# Altium schematic sheet Done.SchDoc
size A4; Organization: Altium Limited; Address1: L3, 12a Rodborough Rd; Address2: Frenchs Forest; Address3: NSW; Address4: Australia 2086
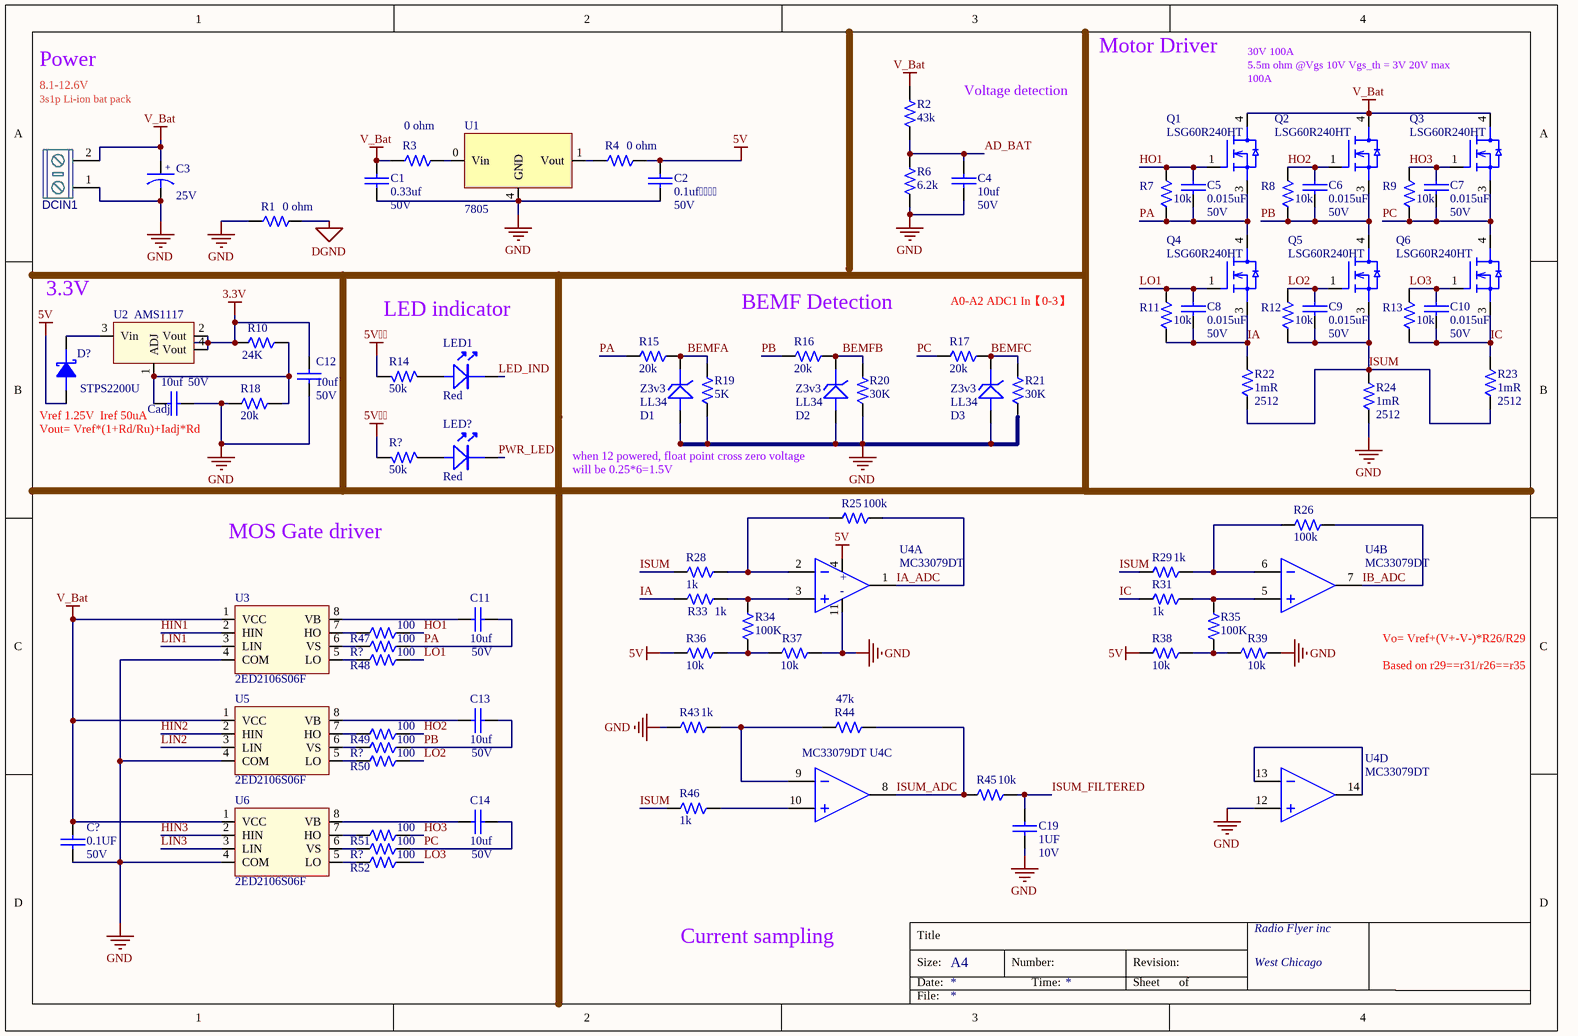
[diagram p0: Done.SchDoc]

## Parts
(Parts that share a designator on the sheet are numbered #1, #2 ... from top to bottom, then left to right.)
C1  value 0.33uf  Voltage: 50V  [CAPC0603-RW]  (hidden comment: PXL456470-1530)
C2  value 0.1uf  Voltage: 50V  [CAPC0603-RW]  (hidden comment: PXL456470-1530)
C3  Voltage: 25V  [CASE - G]  (hidden comment: PBE099550-4710)
C4  value 10uf  Voltage: 50V  [CAPC0603-RW]  (hidden comment: PXL456470-1530)
C5  value 0.015uF  Voltage: 50V  [CAPC0603-RW]  (hidden comment: PXL456470-1530)
C6  value 0.015uF  Voltage: 50V  [CAPC0603-RW]  (hidden comment: PXL456470-1530)
C7  value 0.015uF  Voltage: 50V  [CAPC0603-RW]  (hidden comment: PXL456470-1530)
C8  value 0.015uF  Voltage: 50V  [CAPC0603-RW]  (hidden comment: PXL456470-1530)
C9  value 0.015uF  Voltage: 50V  [CAPC0603-RW]  (hidden comment: PXL456470-1530)
C10  value 0.015uF  Voltage: 50V  [CAPC0603-RW]  (hidden comment: PXL456470-1530)
C11  value 10uf  Voltage: 50V  [CAPC0603-RW]  (hidden comment: PXL456470-1530)
C12  value 10uf  Voltage: 50V  [CAPC0603-RW]  (hidden comment: PXL456470-1530)
C13  value 10uf  Voltage: 50V  [CAPC0603-RW]  (hidden comment: PXL456470-1530)
C14  value 10uf  Voltage: 50V  [CAPC0603-RW]  (hidden comment: PXL456470-1530)
C19  value 1UF  Voltage: 10V  [CAPC0603-SW]  (hidden comment: PXL456470-1530)
C?  value 0.1UF  Voltage: 50V  [CAPC0603-RW]  (hidden comment: PXL456470-1530)
Cadj  value 10uf  Voltage: 50V  [CAPC0603-RW]  (hidden comment: PXL456470-1530)
D1  MFG Part: Z3v3  [LL34]  (hidden comment: RCZ005015-0020)
D2  MFG Part: Z3v3  [LL34]  (hidden comment: RCZ005015-0020)
D3  MFG Part: Z3v3  [LL34]  (hidden comment: RCZ005015-0020)
D?  MFG Part: STPS2200U  [SMB]  (hidden comment: DIO STPS2200U)
DCIN1  KF/WJ/DG 30x connecter  [KF/WJ/DG 301-2p-5.0mm]  (value not drawn)
LED1  Color: Red  [LED1206-RED]  (hidden comment: LED1206R_23-21\R6C-AM1N2AY\2A)
LED?  Color: Red  [LED1206-RED]  (hidden comment: LED1206R_23-21\R6C-AM1N2AY\2A)
Q1  MFG Part: LSG60R240HT  [TO252-3]  (hidden comment: T5860038503A6)
Q2  MFG Part: LSG60R240HT  [TO252-3]  (hidden comment: T5860038503A6)
Q3  MFG Part: LSG60R240HT  [TO252-3]  (hidden comment: T5860038503A6)
Q4  MFG Part: LSG60R240HT  [TO252-3]  (hidden comment: T5860038503A6)
Q5  MFG Part: LSG60R240HT  [TO252-3]  (hidden comment: T5860038503A6)
Q6  MFG Part: LSG60R240HT  [TO252-3]  (hidden comment: T5860038503A6)
R1  value 0 ohm  [0603-RW]  (hidden comment: T502210202399)
R2  value 43k  [0603-RW]  (hidden comment: T5024421083A9)
R3  value 0 ohm  [0603-RW]  (hidden comment: T502210202399)
R4  value 0 ohm  [0603-RW]  (hidden comment: T502210202399)
R6  value 6.2k  [0603-RW]  (hidden comment: T5024421083A9)
R7  value 10k  [0603-RW]  (hidden comment: T5024421083A9)
R8  value 10k  [0603-RW]  (hidden comment: T5024421083A9)
R9  value 10k  [0603-RW]  (hidden comment: T5024421083A9)
R10  value 24K  [0603-RW]  (hidden comment: T5024421083A9)
R11  value 10k  [0603-RW]  (hidden comment: T5024421083A9)
R12  value 10k  [0603-RW]  (hidden comment: T5024421083A9)
R13  value 10k  [0603-RW]  (hidden comment: T5024421083A9)
R14  value 50k  [0603-RW]  (hidden comment: T5024421083A9)
R15  value 20k  [0603-RW]  (hidden comment: T5024421083A9)
R16  value 20k  [0603-RW]  (hidden comment: T5024421083A9)
R17  value 20k  [0603-RW]  (hidden comment: T5024421083A9)
R18  value 20k  [0603-RW]  (hidden comment: T5024421083A9)
R19  value 5K  [0603-RW]  (hidden comment: T5024421083A9)
R20  value 30K  [0603-RW]  (hidden comment: T5024421083A9)
R21  value 30K  [0603-RW]  (hidden comment: T5024421083A9)
R22  value 1mR  [2512]  (hidden comment: QCF101250-1009)
R23  value 1mR  [2512]  (hidden comment: QCF101250-1009)
R24  value 1mR  [2512]  (hidden comment: QCF101250-1009)
R25  value 100k  [0603-RW]  (hidden comment: T5024421083A9)
R26  value 100k  [0603-RW]  (hidden comment: T5024421083A9)
R28  value 1k  [0603-RW]  (hidden comment: T5024421083A9)
R29  value 1k  [0603-RW]  (hidden comment: T5024421083A9)
R31  value 1k  [0603-RW]  (hidden comment: T5024421083A9)
R33  value 1k  [0603-RW]  (hidden comment: T5024421083A9)
R34  value 100K  [0603-RW]  (hidden comment: T5024421083A9)
R35  value 100K  [0603-RW]  (hidden comment: T5024421083A9)
R36  value 10k  [0603-RW]  (hidden comment: T5024421083A9)
R37  value 10k  [0603-RW]  (hidden comment: T5024421083A9)
R38  value 10k  [0603-RW]  (hidden comment: T5024421083A9)
R39  value 10k  [0603-RW]  (hidden comment: T5024421083A9)
R43  value 1k  [0603-RW]  (hidden comment: T5024421083A9)
R44  value 47k  [0603-RW]  (hidden comment: T5024421083A9)
R45  value 10k  [0603-RW]  (hidden comment: T5024421083A9)
R46  value 1k  [0603-RW]  (hidden comment: T5024421083A9)
R47  value 100  [0603-RW]  (hidden comment: T5024421083A9)
R48  value 100  [0603-RW]  (hidden comment: T5024421083A9)
R49  value 100  [0603-RW]  (hidden comment: T5024421083A9)
R50  value 100  [0603-RW]  (hidden comment: T5024421083A9)
R51  value 100  [0603-RW]  (hidden comment: T5024421083A9)
R52  value 100  [0603-RW]  (hidden comment: T5024421083A9)
R?#1  value 50k  [0603-RW]  (hidden comment: T5024421083A9)
R?#2  value 100  [0603-RW]  (hidden comment: T5024421083A9)
R?#3  value 100  [0603-RW]  (hidden comment: T5024421083A9)
R?#4  value 100  [0603-RW]  (hidden comment: T5024421083A9)
U1  7805  [TO-263]
U2  AMS1117  [SOT223]
U3  T610900027257  [SO8]  (value not drawn)
U4  RCI033079-0002  [SO14]  (value not drawn)  (parts A,B,C,D of 4)
U5  T610900027257  [SO8]  (value not drawn)
U6  T610900027257  [SO8]  (value not drawn)

## Nets
3.3V: C12.1 R10.2 U2.2(Vout) U2.4(Vout)
5V: C2.1 D?.1(A) R4.2 R36.2 R38.2 U4.4(+V)
5V: R14.1 R?#1.1
DGND: R1.2
GND: C1.2 C2.2 C3.2 C4.2 C12.2 C19.1 C?.1 Cadj.2 D1.1(A) D2.1(A) D3.1(A) DCIN1.1 R1.1 R6.2 R18.2 R19.2 R20.2 R21.2 R24.1 R37.1 R39.1 R43.2 U1.4(GND) U3.4(COM) U4.11(-V) U4.12(IN+) U5.4(COM) U6.4(COM)
V_Bat: C1.1 C3.1 C?.2 DCIN1.2 Q1.4(D) Q2.4(D) Q3.4(D) R2.1 R3.1 U3.1(VCC) U5.1(VCC) U6.1(VCC)
AD_BAT: C4.1 R2.2 R6.1
BEMFA: D1.2(K) R15.1 R19.1
BEMFB: D2.2(K) R16.1 R20.1
BEMFC: D3.2(K) R17.1 R21.1
HIN1: U3.2(HIN)
HIN2: U5.2(HIN)
HIN3: U6.2(HIN)
HO1: C5.2 Q1.1(G) R7.2 R47.1
HO2: C6.2 Q2.1(G) R8.2 R49.1
HO3: C7.2 Q3.1(G) R9.2 R51.1
IA: C8.1 Q4.3(S) R11.1 R22.2 R33.2
IA_ADC: R25.1 U4.1(OUT)
IB_ADC: R26.1 U4.7(OUT)
IC: C10.1 Q6.3(S) R13.1 R23.2 R31.2
ISUM: C9.1 Q5.3(S) R12.1 R22.1 R23.1 R24.2 R28.2 R29.2 R46.2
ISUM_ADC: R44.1 R45.2 U4.8(OUT)
ISUM_FILTERED: C19.2 R45.1
LED_IND: LED1.2(K)
LIN1: U3.3(LIN)
LIN2: U5.3(LIN)
LIN3: U6.3(LIN)
LO1: C8.2 Q4.1(G) R11.2 R48.1
LO2: C9.2 Q5.1(G) R12.2 R50.1
LO3: C10.2 Q6.1(G) R13.2 R52.1
PA: C5.1 C11.2 Q1.3(S) Q4.4(D) R7.1 R15.2 R?#2.1
PB: C6.1 C13.2 Q2.3(S) Q5.4(D) R8.1 R16.2 R?#3.1
PC: C7.1 C14.2 Q3.3(S) Q6.4(D) R9.1 R17.2 R?#4.1
PWR_LED: LED?.2(K)
NetC11_1: C11.1 U3.8(VB)
NetC13_1: C13.1 U5.8(VB)
NetC14_1: C14.1 U6.8(VB)
NetCadj_1: Cadj.1 R10.1 R18.1 U2.1(ADJ)
NetD?_2: D?.2(K) U2.3(Vin)
NetLED1_1: LED1.1(A) R14.2
NetLED?_1: LED?.1(A) R?#1.2
NetR3_2: R3.2 U1.0(Vin)
NetR4_1: R4.1 U1.1(Vout)
NetR25_2: R25.2 R28.1 U4.2(IN-)
NetR26_2: R26.2 R29.1 U4.6(IN-)
NetR31_1: R31.1 R35.1 U4.5(IN+)
NetR33_1: R33.1 R34.1 U4.3(IN+)
NetR34_2: R34.2 R36.1 R37.2
NetR35_2: R35.2 R38.1 R39.2
NetR43_1: R43.1 R44.2 U4.9(IN-)
NetR46_1: R46.1 U4.10(IN+)
NetR47_2: R47.2 U3.7(HO)
NetR48_2: R48.2 U3.5(LO)
NetR49_2: R49.2 U5.7(HO)
NetR50_2: R50.2 U5.5(LO)
NetR51_2: R51.2 U6.7(HO)
NetR52_2: R52.2 U6.5(LO)
NetR?#2_2: R?#2.2 U3.6(VS)
NetR?#3_2: R?#3.2 U5.6(VS)
NetR?#4_2: R?#4.2 U6.6(VS)
NetU4_13: U4.13(IN-) U4.14(OUT)

## Notes on the sheet
- Power
- 3s1p Li-ion bat pack
- 8.1-12.6V
- Voltage detection
- Motor Driver
- 30V 100A
- 5.5m ohm @Vgs 10V Vgs_th = 3V 20V max
- (near Q1) 100A
- 3.3V
- BEMF Detection
- A0-A2 ADC1 In【0-3】
- LED indicator
- (near Cadj) Vref 1.25V  Iref 50uA
- Vout= Vref*(1+Rd/Ru)+Iadj*Rd
- when 12 powered, float point cross zero voltage
- will be 0.25*6=1.5V
- MOS Gate driver
- Vo= Vref+(V+-V-)*R26/R29
- Based on r29==r31/r26==r35
- Current sampling
- Title
- Size:
- Date:
- A4
- Number:
- Time:
- Revision:
- Sheet
- of
- Radio Flyer inc
- West Chicago
- File:
- (in symbol CAP E 470uF 25V 20% SMD) +
- (in symbol MC33079DT, part A) +; -

## Library data of the parts
C1 C2 C4-C14 C19 C? = CAP0603 0.015uF 50V 10%: GP CHIP CAP 0.015uF 50V 10% 0603 TYPE X7R; SAP: T542021537508; Vendor Code: 10010262; Vendor Name: 东莞市晴远电子有限公司; Type: Capacitor; DIP&SMD: SMD; PACKAGE: CAPC0603; MFG: *; MFG Part: *; Other: X7R; Tolerance: 10%; Customer Specific: N/A
C3 = CAP E 470uF 25V 20% SMD: CHIP ELECT 470uF 25V 20% D10xL10 105; SAP: T551471445000; Vendor Name: 东莞市晴远电子有限公司; Vendor Code: 10010262; Type: Capacitor; DIP&SMD: SMD; PACKAGE: CASE - G; MFG: *; MFG Part: *; Other: *; Tolerance: 20%; Customer Specific: N/A
Cadj = CAP0603 0.015uF 50V 10%: GP CHIP CAP 0.015uF 50V 10% 0603 TYPE X7R; SAP: T542021537508; Vendor Code: 10010262; Vendor Name: 东莞市晴远电子有限公司; DIP&SMD: SMD; PACKAGE: CAPC0603; MFG: *; MFG Part: *; Other: X7R; Tolerance: 10%; Type: Capacitor; Customer Specific: N/A
D1-D3 = TCLLZ15V: CHIP ZENER 15V 0.5W MLL34; SAP: T573003832016; Vendor Code: 10009207; Vendor Name: MOBICON HOLDINGS LTD.; MFG: TAK CHEONG; Current: 5MA; Tolerance: 5%; Power: 500MW; DIP&SMD: SMD; VOLTAGE: 15V; Type: ZENER; Customer Specific: N/A; Package: LL34
D? = DIO STPS2200U: DIODE SCHOTTKY 200V 2A SMB; MFG: STMicroelectronics; DIP&SMD: SMD; CREATE_NAME: Nathan; SAP: *; Vendor Name: *; Vendor Code: *; Voltage: *; Current: *; Type: DIODE; Customer Specific: N/A; CREATE_TIME: 19-Jun-2020; Package: SMB
DCIN1 = KF/WJ/DG 30x: 接线端子 2Pin
LED1 LED? = LED1206R_23-21\R6C-AM1N2AY\2A: CHIP LED RED TYPE 1206; MFG: EVERLIGHT; DIP&SMD: SMD; CREATE_NAME: Nathan; MFG Part: 23-21\R6C-AM1N2AY\2A; SAP: *; Package: 1206; Type: LED; CREATE_TIME: 18-Aug-2020
Q1-Q6 = NMOS LSG60R240HT: NMOS 600V LSG60R240HT TO252( LONTEN K; Current: 17A; Type: N-CHANNEL MOSFET; CREATE_NAME: Nathan; DIP&SMD: SMD; SAP: T5860038503A6; Pd: *; Vendor Code: *; Vendor Name: *; Voltage: 600V; MFG: LONTEN; CREATE_TIME: 12-Oct-2019; Rds: *; Customer Specific: N/A; Package: TO252
R1 R3 R4 = RES0603 1/16W 1% 21K OMH_WALSIN: CHIP 21K OHM 100PPM +-1% 0603 WALS L; TOL: 1%; MFG: WALSIN (華新); Power: 1/10W; CREATE_NAME: Nathan; DIP&SMD: SMD; SAP: T502210202399; Package: 0603; MFG Part: *; Vendor Code: *; Vendor Name: *; Type: Resistor; CREATE_TIME: 08-Feb-2018; Customer Specific: N/A
R2 R6-R21 R25 R26 R28 R29 R31 R33-R39 R43-R52 R?#1-R?#4 = RES0201 1/20W 1% 4.42K OHM_WALSIN: CHIP 4.42K OHM 200PPM +-1% 0201 WALS L; MFG Part: WR02X4421FAL; Power: 1/20W; MFG: WALSIN (華新); TOL: 1%; CREATE_NAME: Nathan; DIP&SMD: SMD; Vendor Code: *; SAP: T5024421083A9; Vendor Name: *; Type: Resistor; PACKAGE: 0603; CREATE_TIME: 23-July-2019; Customer Specific: N/A
R22-R24 = RES2512 1W 1% 10 OHM: CHIP RES. 10 OHM 1W 1% 2512; Vendor Code: 10010262; SAP: T502100A07399; Vendor Name: 东莞市晴远电子有限公司; DIP&SMD: SMD; Power: 1W; MFG Part: *; MFG: *; TOL: 1%; Type: Resistor; Customer Specific: N/A; PACKAGE: 2512
U2 = AMS1117: 800mA LOW DROPOUT VOLTAGE REGULATOR , SOT-223; MFG: Advanced Monolithic Systems; CREATE_NAME: Nathan; DIP&SMD: SMD; SAP: *; Vendor Code: *; Vendor Name: *; Type: IC; CREATE_TIME: 17-Nov-2020; Package: SOT-223; Customer Specific: N/A; MFG Part: AMS1117
U3 U5 U6 = 2ED2106S06F: DRIVER 2ED2106S06F DSO-8 INFINEO K; MFG: Infineon; CREATE_NAME: Nathan; DIP&SMD: SMD; Vendor Code: *; Vendor Name: *; SAP: T610900027257; Type: IC; CREATE_TIME: 14-Apr-2020; Customer Specific: N/A; MFG Part: 2ED2106S06F
U4 = MC33079DT: IC opamp quad MC33079 bipolar SO14; SAP: T610500026102; MFG: STMICROELECTRONICS; DIP&SMD: SMD; Vendor Code: *; Vendor Name: *; Type: IC; Customer Specific: N/A; MFG Part: MC33079DT